# EasyEDA Pro project 小张FOC-STM32G431CBU6.epro, schematic 控制板
Create Date: 2024-04-24; Page Name: P1; Project Name: 小张FOC-STM32G431CBU6; Schematic Name: 控制板; Update Date: 2024-09-16
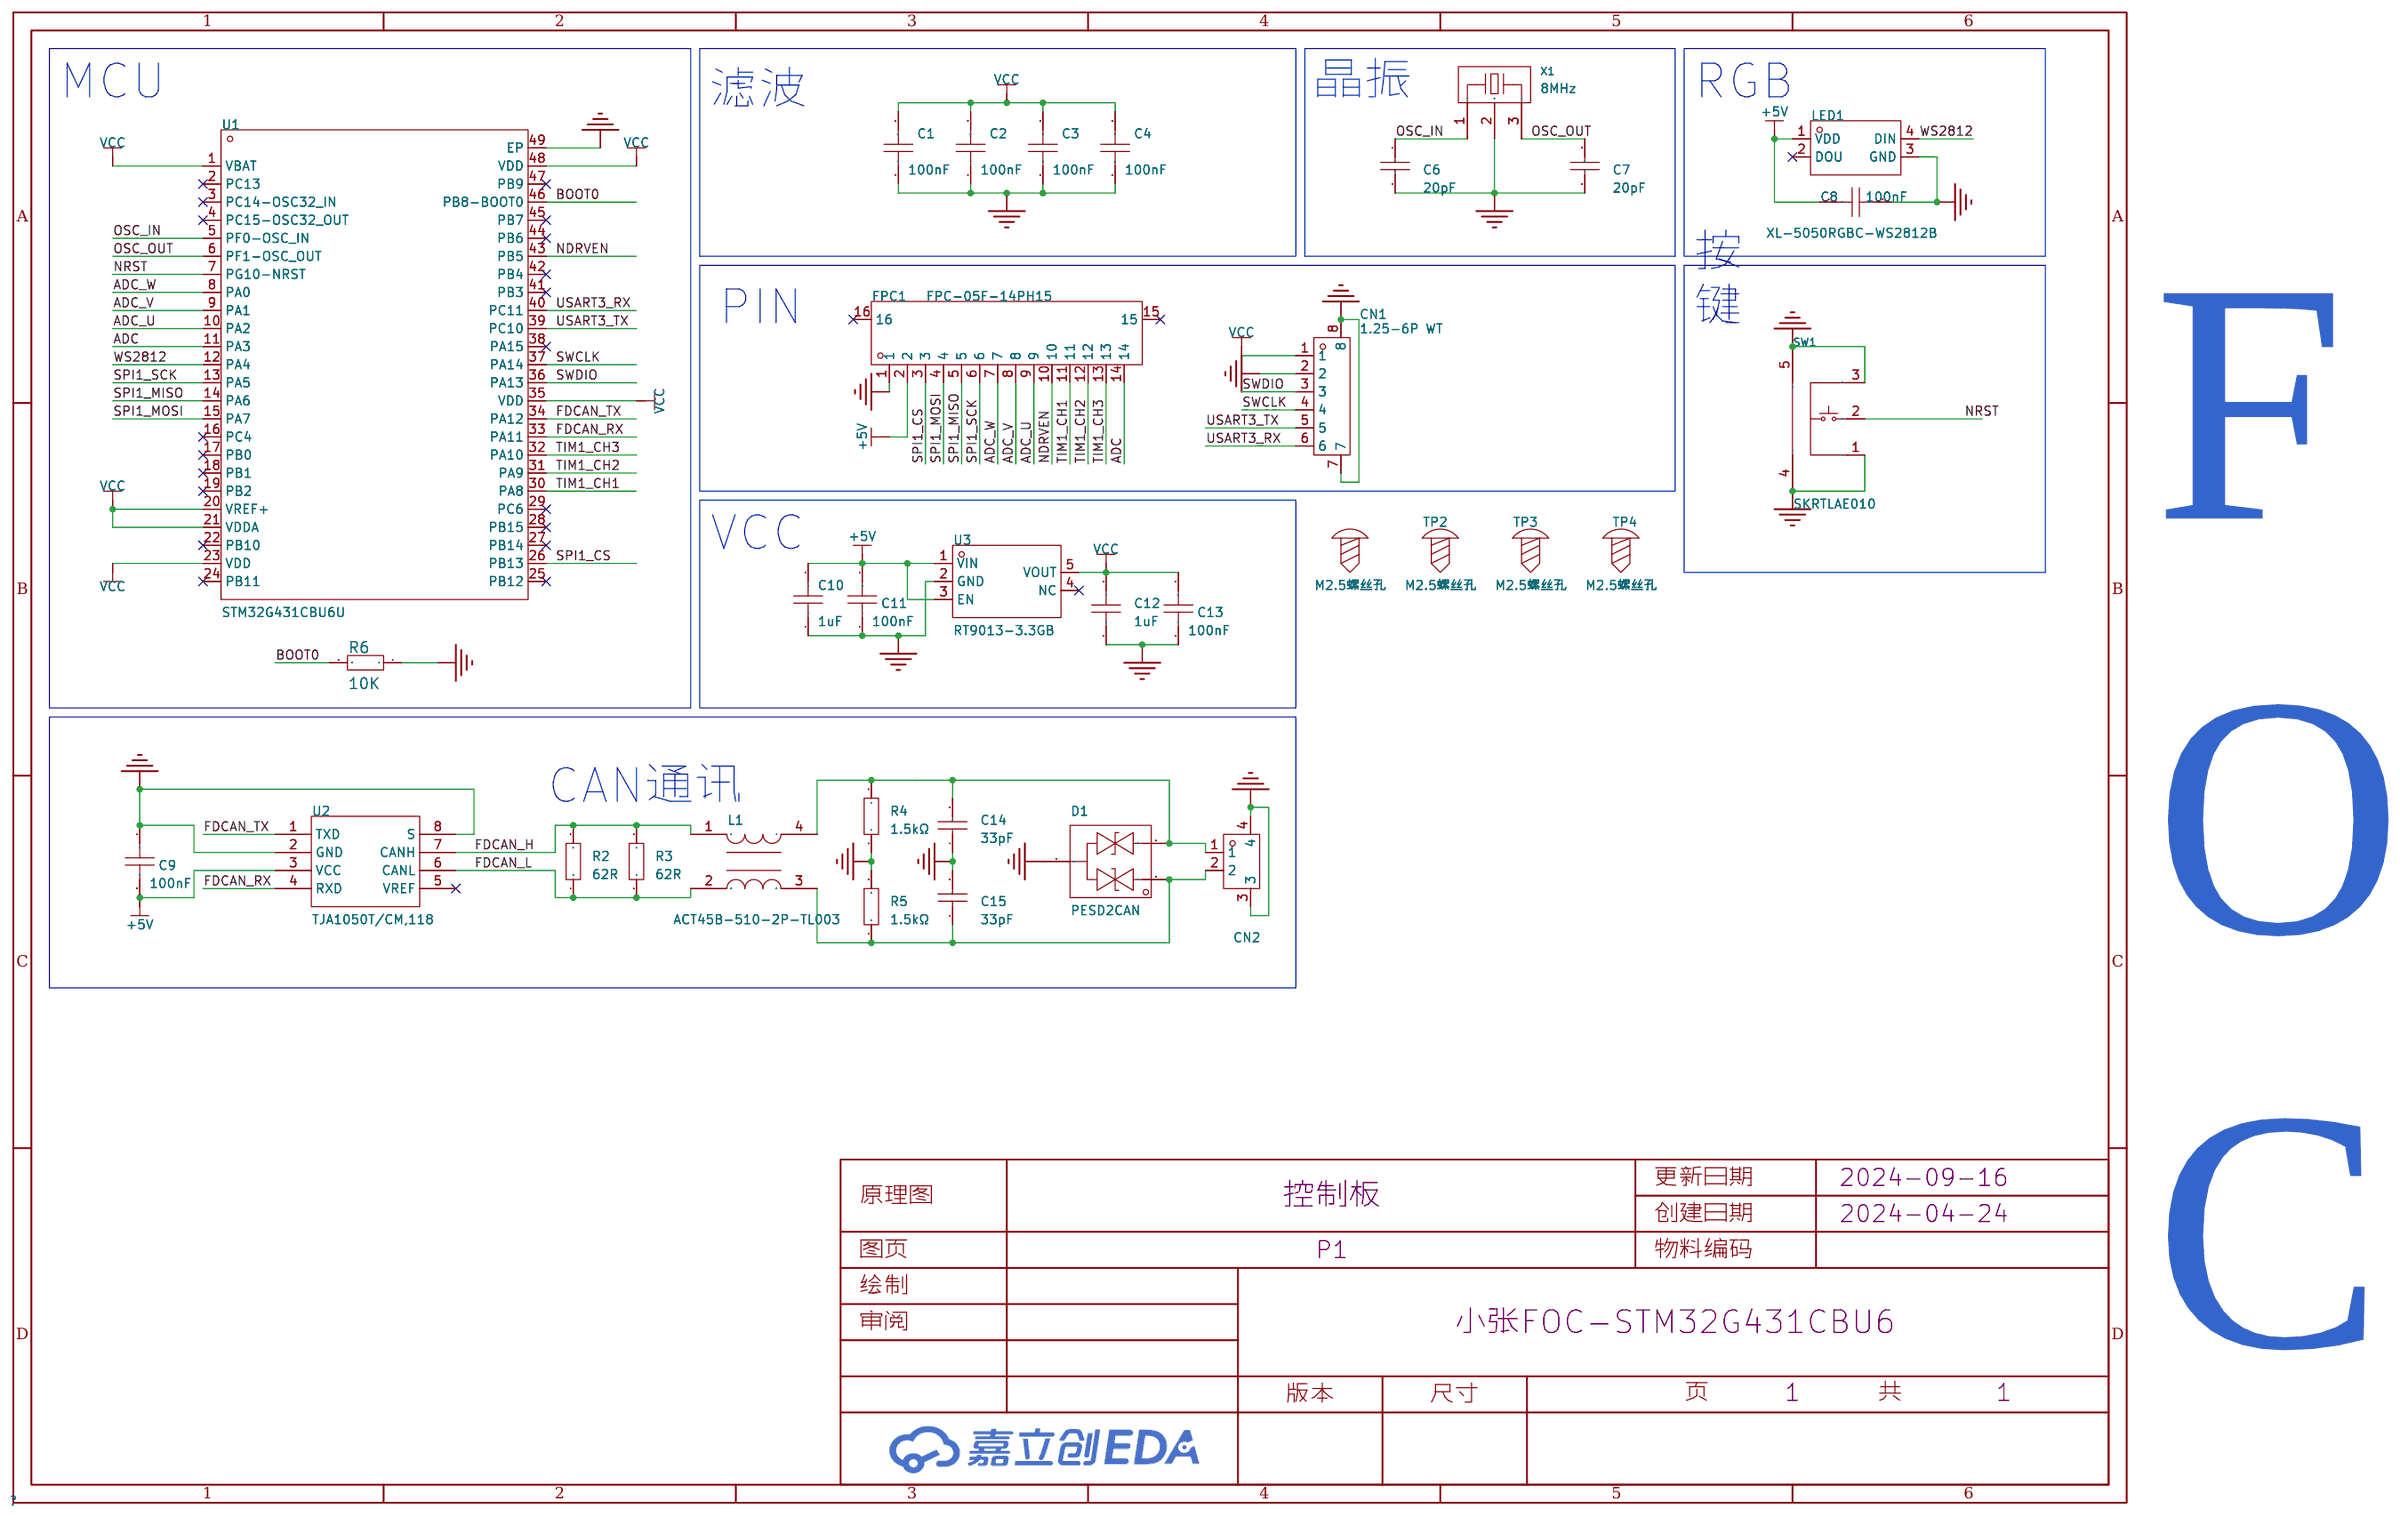
[diagram p0: schematic sheet]

## Parts
C1  100nF  [C0603_SMALL]
C2  100nF  [C0603_SMALL]
C3  100nF  [C0603_SMALL]
C4  100nF  [C0603_SMALL]
C6  20pF  [C0603_SMALL]
C7  20pF  [C0603_SMALL]
C8  100nF  [C0603_SMALL]
C9  100nF  [C0603_SMALL]
C10  1uF  [C0603_SMALL]
C11  100nF  [C0603_SMALL]
C12  1uF  [C0603_SMALL]
C13  100nF  [C0603_SMALL]
C14  33pF  [C0603_SMALL]
C15  33pF  [C0603_SMALL]
CN1  1.25-6P WT  [CONN-SMD_1.25-6PWT]
CN2  X1251WRS-02HF-LPSW  [CONN-SMD_2P-P1.25_X1251WRS-02HF-LPSW]
D1  PESD2CAN  [SOT-23-3_L2.9-W1.3-P1.90-LS2.4-BR]
FPC1  FPC-05F-14PH15  [FPC-SMD_14P-P0.50_XUNPU_FPC-05F-14PH15]
L1  ACT45B-510-2P-TL003  [IND-SMD_4P-L4.5-W3.2-TL]
LED1  XL-5050RGBC-WS2812B  [LED-SMD_4P-L5.0-W5.0-BL_XL-5050RGBC]
R2  62R  [R0603_SMALL]
R3  62R  [R0603_SMALL]
R4  1.5kΩ  [R0603_SMALL]
R5  1.5kΩ  [R0603_SMALL]
R6  10K  [R0603_SMALL]
SW1  SKRTLAE010  [KEY-SMD_SKRTLAE010]
TP2  M2.5螺丝孔  [X-M2.5螺丝孔]
TP3  M2.5螺丝孔  [X-M2.5螺丝孔]
TP4  M2.5螺丝孔  [X-M2.5螺丝孔]
U1  STM32G431CBU6U  [UFQFPN-48_L7.0-W7.0-P0.50-BL-EP5.6]
U2  TJA1050T/CM,118  [SOIC-8_L5.0-W4.0-P1.27-LS6.0-BL]
U3  RT9013-3.3GB  [SOT-23-5_L2.9-W1.6-P0.94-LS2.8-BL]
X1  8MHz  [OSC-SMD_3P-L3.2-W1.3-P1.2-L]

## Library data of the parts
C1-C4 C8 C9 = 0603B104K500NT: 容值:100nF;精度:±10%;额定电压:50V;材质(温度系数):X7R;; LCSC Part Name: 100nF ±10% 50V; Supplier Part: C30926; Manufacturer: FH(风华); Supplier Footprint: 0603; JLCPCB Part Class: Extended Part; Datasheet: https://atta.szlcsc.com/upload/public/pdf/source/20200305/C486355_26A10D38EF8C2A5C37091D0039909270.pdf; Supplier: LCSC; Tolerance: ±10%; Voltage Rated: 50V; Temperature Coefficient: X7R
C6 C7 = 20pF: LCSC Part Name: 20pF±5%50V; Supplier Part: C1648; Manufacturer: SAMSUNG(三星); Manufacturer Part: CL10C200JB8NNNC; Supplier Footprint: 0603; JLCPCB Part Class: 基础库; Datasheet: https://atta.szlcsc.com/upload/public/pdf/source/20160103/1457707686863.pdf; Supplier: LCSC; Tolerance: ±5%; Voltage Rated: 50V; Temperature Coefficient: C0G; Origin Footprint 2: C0603; Origin Footprint 1: CL10C200JB8NNNC
C10 C12 = CL10A105KB8NNNC: 容值:1uF;精度:±10%;额定电压:50V;材质(温度系数):X5R;; LCSC Part Name: 1uF ±10% 50V; Supplier Part: C15849; Manufacturer: SAMSUNG(三星); Supplier Footprint: 0603; JLCPCB Part Class: 基础库; Datasheet: https://atta.szlcsc.com/upload/public/pdf/source/20160218/1457707763339.pdf; Supplier: LCSC; Tolerance: ±10%; Voltage Rated: 50V; Temperature Coefficient: X5R
C11 C13 = CC0603KRX7R9BB104: 容值:100nF;精度:±10%;额定电压:50V;材质(温度系数):X7R;; LCSC Part Name: 100nF ±10% 50V; Supplier Part: C14663; Manufacturer: YAGEO(国巨); Supplier Footprint: 0603; JLCPCB Part Class: 基础库; Datasheet: https://atta.szlcsc.com/upload/public/pdf/source/20180910/C282072_33301C7F631E79921B82A8DAC6BCC5B3.pdf; Supplier: LCSC; Tolerance: ±10%; Voltage Rated: 50V; Temperature Coefficient: X7R
C14 C15 = CL10C330JB8NNNC: 容值:33pF;精度:±5%;额定电压:50V;材质(温度系数):C0G;; LCSC Part Name: 33pF ±5% 50V; Supplier Part: C1663; Manufacturer: SAMSUNG(三星); Supplier Footprint: 0603; Datasheet: https://atta.szlcsc.com/upload/public/pdf/source/20160218/1457707763339.pdf; Supplier: LCSC; Tolerance: ±5%; Voltage Rated: 50V; Temperature Coefficient: C0G
CN1 = 1.25-6P WT: 插针结构:1x6P;间距:1.25mm;安装方式:卧贴;参考系列:-;总PIN数:6P;排数:1;每排PIN数:6;行距:-;额定电流:1A;工作温度范围:-25℃~+85℃;; LCSC Part Name: 1x6P 间距:1.25mm 卧贴; Supplier Part: C668617; Manufacturer: SHOU HAN(首韩); Supplier Footprint: SMD,P=1.25mm,卧贴; JLCPCB Part Class: 扩展库; Datasheet: https://atta.szlcsc.com/upload/public/pdf/source/20200618/C668617_2618E8037EA4B5DDA2614CE7F66138E1.pdf; Supplier: LCSC; Pins Structure: 1x6P; Pitch: 1.25mm; Mounting Style: 卧贴; Number of Pins: 6P; Number of Rows: 1; Number of PINs Per Row: 6; Current Rating (Max): 1A; Operating Temperature Range: -25℃~+85℃
CN2 = X1251WRS-02HF-LPSW: 插针结构:1x2P;间距:1.25mm;安装方式:卧贴;参考系列:GH;总PIN数:2P;排数:1;每排PIN数:2;行距:-;额定电流:1A;触头材质:黄铜;触头镀层:锡;工作温度范围:-;; LCSC Part Name: 1x2P 间距:1.25mm 卧贴 系列:GH; Supplier Part: C388707; Manufacturer: XKB Connection(中国星坤); Supplier Footprint: SMD,P=1.25mm,卧贴; JLCPCB Part Class: 扩展库; Datasheet: https://atta.szlcsc.com/upload/public/pdf/source/20211011/E2F7306AE87519079AD4EC816349A567.pdf; Supplier: LCSC; Pins Structure: 1x2P; Pitch: 1.25mm; Mounting Style: 卧贴; Reference Series: GH; Number of Pins: 2P; Number of Rows: 1; Number of PINs Per Row: 2; Current Rating (Max): 1A; Contact Material: 黄铜; Contact Plating: 锡
D1 = PESD2CAN: 反向截止电压(Vrwm):24V@Max;最大钳位电压:54V;峰值脉冲电流(Ipp)@10/1000us:8A@8/20us;击穿电压:26.7V;; Supplier Part: C284078; Manufacturer: DOWO(东沃); Supplier Footprint: SOT-23; JLCPCB Part Class: 扩展库; Datasheet: https://atta.szlcsc.com/upload/public/pdf/source/20230921/5DB54E5D01FEC7F58784754D5D9F31B2.pdf; Supplier: LCSC; Reverse Stand-Off Voltage (Vrwm): 24V@Max; Maximum Clamping Voltage: 54V; Peak Pulse Current (Ipp)@10/1000us: 8A@8/20us; Breakdown Voltage: 26.7V; Type: TVS
FPC1 = FPC-05F-14PH15: 锁定特性:翻盖式;触点类型:下接;触点数量:14P;间距:0.5mm;安装类型:卧贴;工作温度范围:-25℃~+85℃;; LCSC Part Name: 间距:0.5mm P数:14P 翻盖式 下接; Supplier Part: C2856818; Manufacturer: XUNPU(讯普); Supplier Footprint: SMD,P=0.5mm,卧贴; JLCPCB Part Class: 扩展库; Datasheet: https://atta.szlcsc.com/upload/public/pdf/source/20210922/C2856818_BF9A09706769A6AB1B749235C5052B10.pdf; Supplier: LCSC; Locking Feature: 翻盖式; Contact Type: 下接; Number of Contacts: 14P; Pitch: 0.5mm; Mounting Type: 卧贴; FFC, FCB Thickness: 0.3mm; Height Above Board: 1.5mm; Operating Temperature Range: -25℃~+85℃
L1 = ACT45B-510-2P-TL003: 线路数:2;电感 @ 频率:51uH@100kHz;阻抗 @ 频率:2.8kΩ@10MHz;直流电阻(DCR):1Ω;; LCSC Part Name: 两路 4532共模滤波器 阻抗2.8kΩ@10MHz; Supplier Part: C76584; Manufacturer: TDK; Supplier Footprint: SMD,4.5x3.2mm; JLCPCB Part Class: 扩展库; Datasheet: https://atta.szlcsc.com/upload/public/pdf/source/20160918/1474166842057.pdf; Supplier: LCSC; Number of Lines: 2; Withstanding Voltage: 250V@2Secs; Current Rating: 200mA; Inductance @ Frequency: 51uH@100kHz; Voltage Rating - DC: 50V; Impedance @ Frequency: 2.8kΩ@10MHz; DC Resistance (DCR): 1Ω; Operating Temperature: -40℃~+150℃
LED1 = XL-5050RGBC-WS2812B: 发光颜色:RGB三色;功率:-;正向电流:-;主波长:-;二极管配置:-;透镜颜色:无色透明透镜;色温:-;发光角度:120°;载带方式:正贴;工作温度:-20℃~+85℃;; Supplier Part: C2843785; Manufacturer: XINGLIGHT(成兴光); Supplier Footprint: SMD5050; JLCPCB Part Class: 扩展库; Datasheet: https://atta.szlcsc.com/upload/public/pdf/source/20230111/86AAD2096485A2E5BCAB883FF8CBE6FD.pdf; Supplier: LCSC; Emitted Color: RGB三色; Peak Wavelength: 625nm；470nm；530nm; Lens Color: 无色透明透镜; Viewing Angle: 120°; Mounting Sytle: 正贴; Operating Temperature: -20℃~+85℃
R2 R3 = Res_0603: Supplier Footprint: 0603
R4 R5 = 0603WAF1501T5E: 电阻类型:厚膜电阻;阻值:1.5kΩ;精度:±1%;功率:100mW;最大工作电压:75V;温度系数:±100ppm/℃;; LCSC Part Name: 1.5kΩ ±1% 100mW 厚膜电阻; Supplier Part: C22843; Manufacturer: UNI-ROYAL(厚声); Supplier Footprint: 0603; JLCPCB Part Class: 基础库; Datasheet: https://atta.szlcsc.com/upload/public/pdf/source/20200306/C422600_1E6D84923E4A46A82E41ADD87F860B5C.pdf; Supplier: LCSC; Type: 厚膜电阻; Tolerance: ±1%; Power(Watts): 100mW; Overload Voltage (Max): 75V; Temperature Coefficient: ±100ppm/℃; Operating Temperature Range: -55℃~+155℃
R6 = 10K: 3DModel: R0603; link: https://www.mouser.in/datasheet/2/447/PYu_RT_1_to_0_01_RoHS_L_11-1669912.pdf; Supplier: LCSC; Supplier Part: C2976753; Manufacturer: FH(风华); Manufacturer Part: CMFA103J3600HANT; JLCPCB Part Class: Extended Part
SW1 = SKRTLAE010: 电路结构:单刀单掷;按钮形状:圆形按钮;安装方式:卧贴;开关长度:4.5mm;开关宽度:3.4mm;开关高度:3.3mm;触点电流:50mA;额定电压(DC):12V;带灯:-;机械寿命:-;; LCSC Part Name: 4.5*3.4*3.3mm 卧贴 轻触开关; Supplier Part: C110293; Manufacturer: ALPSALPINE(阿尔卑斯阿尔派); Supplier Footprint: SMD; JLCPCB Part Class: 扩展库; Datasheet: https://atta.szlcsc.com/upload/public/pdf/source/20170428/1493376812809.pdf; Supplier: LCSC; Circuit: 单刀单掷; Actuator Style: 圆形按钮; Mounting Style: 卧贴; Switch Length: 4.5mm; Switch Width: 3.4mm; Switch Height: 3.3mm; Contact Current: 50mA; Voltage Rating (DC): 12V
TP2-TP4 = X-M2.5螺丝孔: _: 3
U1 = STM32G431CBU6U: CPU内核:CM4;程序存储容量:128KB;RAM总容量:32KB;GPIO端口数量:42;工作电压范围:1.71V~3.6V;CPU最大主频:170MHz;程序存储器类型:FLASH;; Supplier Part: C1341712; Manufacturer: ST(意法半导体); Supplier Footprint: UFQFPN-48(7x7); JLCPCB Part Class: 扩展库; Datasheet: https://atta.szlcsc.com/upload/public/pdf/source/20210607/F3CD0646E5D00AAFDE875C196C2D7333.pdf; Supplier: LCSC; CPU Core: CM4; Program Storage Size: 128KB; RAM Size: 32KB; GPIO Ports Number: 42; Operating Voltage Range: 1.71V~3.6V; CPU Maximum Speed: 170MHz; Program Memory Type: FLASH; Operating Temperature Range: -40℃~+85℃; ADC (Bit): 12bit; DAC (Bit): 12bit; Peripheral/Function: PWM；PWM; Internal Oscillator: 有
U2 = TJA1050T/CM,118: 类型:收发器;; LCSC Part Name: 4.75V~5.25V; Supplier Part: C6952; Manufacturer: NXP(恩智浦); Supplier Footprint: SOP-8; JLCPCB Part Class: 扩展库; Datasheet: https://atta.szlcsc.com/upload/public/pdf/source/20140411/1457707042917.pdf; Supplier: LCSC; Type: 收发器; Supply Voltage: 4.75V~5.25V; Supply Current: 50mA
U3 = RT9013-3.3GB: Supplier Part: C9900009203; Supplier Footprint: SOT-23-5; JLCPCB Part Class: 扩展库; Supplier: LCSC
X1 = CSTCE8M00G52-R0: 频率:8MHz;内置负载电容:10pF;谐振阻抗:40Ω;; LCSC Part Name: 8MHz ±0.5% 内置负载电容:10pF; Supplier Part: C22549; Manufacturer: muRata(村田); Supplier Footprint: SMD3213-3P; JLCPCB Part Class: 扩展库; Datasheet: https://atta.szlcsc.com/upload/public/pdf/source/20160120/1457707754326.pdf; Supplier: LCSC; Built-in Load Capacitance: 10pF; Resonant Impedance: 40Ω; Operating Temperature: -20℃~+80℃

## Nets
+5V: C8.2 C9.2 C10.2 C11.2 FPC1.2 LED1.1(VDD) U2.3(VCC) U3.1(VIN) U3.3(EN)
GND: C1.1 C2.1 C3.1 C4.1 C6.2 C7.1 C8.1 C9.1 C10.1 C11.1 C12.1 C13.1 C14.1 C15.2 CN1.2 CN1.7 CN1.8 CN2.3 CN2.4 D1.3 FPC1.1 LED1.3(GND) R4.1 R5.2 R6.1 SW1.1 SW1.3 SW1.4 SW1.5 U1.49(EP) U2.2(GND) U2.8(S) U3.2(GND) X1.2
VCC: C1.2 C2.2 C3.2 C4.2 C12.2 C13.2 CN1.1 U1.1(VBAT) U1.20(VREF+) U1.21(VDDA) U1.23(VDD) U1.35(VDD) U1.48(VDD) U3.5(VOUT)
ADC: FPC1.14 U1.11(PA3)
ADC_U: FPC1.9 U1.10(PA2)
ADC_V: FPC1.8 U1.9(PA1)
ADC_W: FPC1.7 U1.8(PA0)
BOOT0: R6.2 U1.46(PB8-BOOT0)
FDCAN_H: L1.1 R2.2 R3.2 U2.7(CANH)
FDCAN_L: L1.2 R2.1 R3.1 U2.6(CANL)
FDCAN_RX: U1.33(PA11) U2.4(RXD)
FDCAN_TX: U1.34(PA12) U2.1(TXD)
NDRVEN: FPC1.10 U1.43(PB5)
NRST: SW1.2 U1.7(PG10-NRST)
OSC_IN: C6.1 U1.5(PF0-OSC_IN) X1.1
OSC_OUT: C7.2 U1.6(PF1-OSC_OUT) X1.3
SPI1_CS: FPC1.3 U1.26(PB13)
SPI1_MISO: FPC1.5 U1.14(PA6)
SPI1_MOSI: FPC1.4 U1.15(PA7)
SPI1_SCK: FPC1.6 U1.13(PA5)
SWCLK: CN1.4 U1.37(PA14)
SWDIO: CN1.3 U1.36(PA13)
TIM1_CH1: FPC1.11 U1.30(PA8)
TIM1_CH2: FPC1.12 U1.31(PA9)
TIM1_CH3: FPC1.13 U1.32(PA10)
USART3_RX: CN1.6 U1.40(PC11)
USART3_TX: CN1.5 U1.39(PC10)
WS2812: LED1.4(DIN) U1.12(PA4)
$1N5225: C15.1 CN2.2 D1.1 L1.3 R5.1
$1N5235: C14.2 CN2.1 D1.2 L1.4 R4.2

Not connected (* = marked no-connect by the designer): FPC1 15* 16*; LED1 2(DOU)*; U1 2(PC13)* 3(PC14-OSC32_IN)* 4(PC15-OSC32_OUT)* 16(PC4)* 17(PB0)* 18(PB1)* 19(PB2)* 22(PB10)* 24(PB11)* 25(PB12)* 27(PB14)* 28(PB15)* 29(PC6)* 38(PA15)* 41(PB3)* 42(PB4)* 44(PB6)* 45(PB7)* 47(PB9)*; U2 5(VREF)*; U3 4(NC)*

## Notes on the sheet
- MCU
- 晶振
- RGB
- 滤波
- PIN
- 按
  键
- F
  O
  C
- VCC
- CAN通讯
